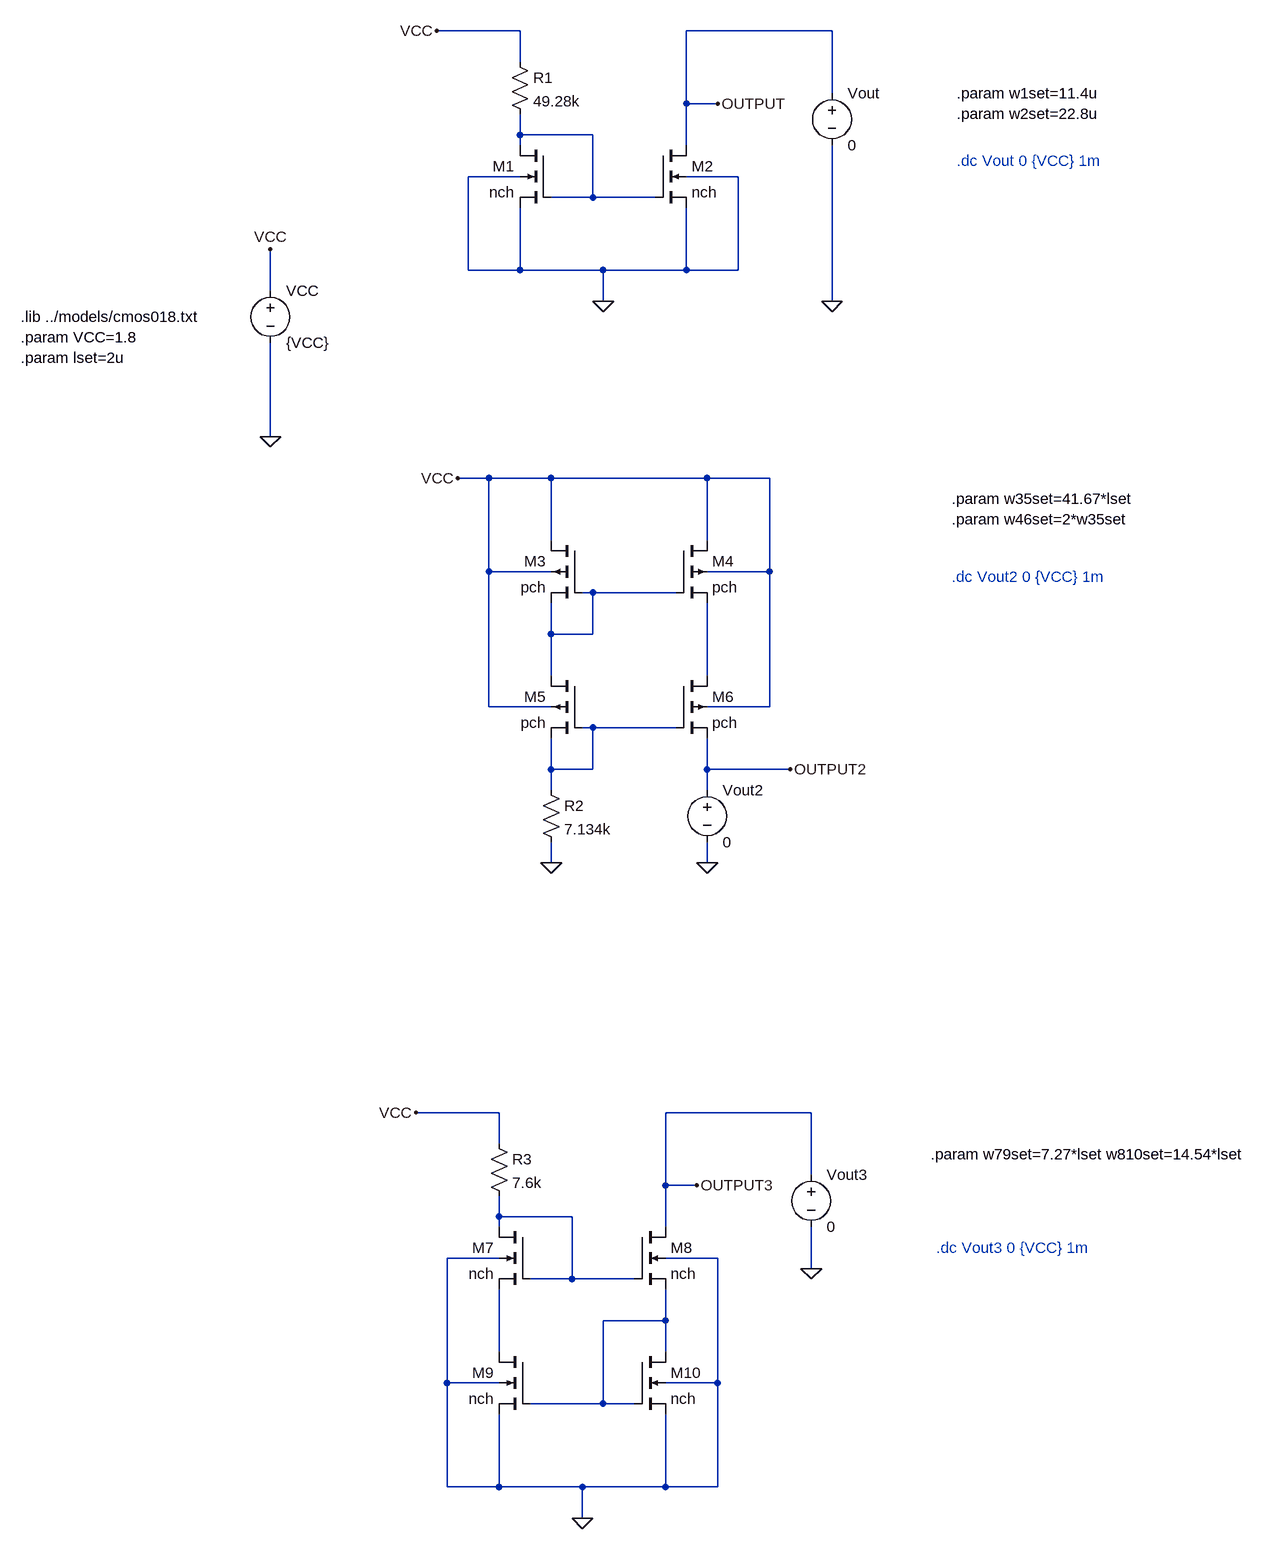
[diagram p0: schematic 2.asc]
2.asc, the LTspice schematic file:
Version 4
SHEET 1 2972 2004
WIRE 736 -304 608 -304
WIRE 1216 -304 992 -304
WIRE 736 -256 736 -304
WIRE 1216 -208 1216 -304
WIRE 992 -192 992 -304
WIRE 1040 -192 992 -192
WIRE 736 -144 736 -176
WIRE 848 -144 736 -144
WIRE 736 -128 736 -144
WIRE 992 -128 992 -192
WIRE 736 -80 656 -80
WIRE 1072 -80 992 -80
WIRE 848 -48 848 -144
WIRE 848 -48 784 -48
WIRE 944 -48 848 -48
WIRE 656 64 656 -80
WIRE 736 64 736 -32
WIRE 736 64 656 64
WIRE 864 64 736 64
WIRE 992 64 992 -32
WIRE 992 64 864 64
WIRE 1072 64 1072 -80
WIRE 1072 64 992 64
WIRE 352 96 352 32
WIRE 864 112 864 64
WIRE 1216 112 1216 -128
WIRE 352 320 352 176
WIRE 688 384 640 384
WIRE 784 384 688 384
WIRE 1024 384 784 384
WIRE 1120 384 1024 384
WIRE 784 480 784 384
WIRE 1024 480 1024 384
WIRE 688 528 688 384
WIRE 784 528 688 528
WIRE 1120 528 1120 384
WIRE 1120 528 1024 528
WIRE 848 560 832 560
WIRE 976 560 848 560
WIRE 784 624 784 576
WIRE 848 624 848 560
WIRE 848 624 784 624
WIRE 784 688 784 624
WIRE 1024 688 1024 576
WIRE 688 736 688 528
WIRE 784 736 688 736
WIRE 1120 736 1120 528
WIRE 1120 736 1024 736
WIRE 848 768 832 768
WIRE 976 768 848 768
WIRE 784 832 784 784
WIRE 848 832 848 768
WIRE 848 832 784 832
WIRE 1024 832 1024 784
WIRE 1152 832 1024 832
WIRE 784 864 784 832
WIRE 1024 864 1024 832
WIRE 784 976 784 944
WIRE 1024 976 1024 944
WIRE 704 1360 576 1360
WIRE 1184 1360 960 1360
WIRE 704 1408 704 1360
WIRE 1184 1456 1184 1360
WIRE 960 1472 960 1360
WIRE 1008 1472 960 1472
WIRE 704 1520 704 1488
WIRE 816 1520 704 1520
WIRE 704 1536 704 1520
WIRE 960 1536 960 1472
WIRE 704 1584 624 1584
WIRE 1040 1584 960 1584
WIRE 1184 1600 1184 1536
WIRE 816 1616 816 1520
WIRE 816 1616 752 1616
WIRE 912 1616 816 1616
WIRE 960 1680 960 1632
WIRE 960 1680 864 1680
WIRE 704 1728 704 1632
WIRE 960 1728 960 1680
WIRE 624 1776 624 1584
WIRE 704 1776 624 1776
WIRE 1040 1776 1040 1584
WIRE 1040 1776 960 1776
WIRE 864 1808 864 1680
WIRE 864 1808 752 1808
WIRE 912 1808 864 1808
WIRE 624 1936 624 1776
WIRE 704 1936 704 1824
WIRE 704 1936 624 1936
WIRE 832 1936 704 1936
WIRE 960 1936 960 1824
WIRE 960 1936 832 1936
WIRE 1040 1936 1040 1776
WIRE 1040 1936 960 1936
WIRE 832 1984 832 1936
FLAG 864 112 0
FLAG 352 320 0
FLAG 352 32 VCC
FLAG 608 -304 VCC
FLAG 1040 -192 OUTPUT
FLAG 1216 112 0
FLAG 640 384 VCC
FLAG 1152 832 OUTPUT2
FLAG 784 976 0
FLAG 1024 976 0
FLAG 576 1360 VCC
FLAG 1008 1472 OUTPUT3
FLAG 1184 1600 0
FLAG 832 1984 0
SYMBOL nmos4 784 -128 M0
SYMATTR InstName M1
SYMATTR Value nch
SYMATTR Value2 l=lset w=w1set
SYMBOL voltage 352 80 R0
WINDOW 123 0 0 Left 0
WINDOW 39 0 0 Left 0
SYMATTR InstName VCC
SYMATTR Value {VCC}
SYMBOL nmos4 944 -128 R0
SYMATTR InstName M2
SYMATTR Value nch
SYMATTR Value2 l=lset w=w2set
SYMBOL res 720 -272 R0
SYMATTR InstName R1
SYMATTR Value 49.28k
SYMBOL voltage 1216 -224 R0
WINDOW 123 0 0 Left 0
WINDOW 39 0 0 Left 0
SYMATTR InstName Vout
SYMATTR Value 0
SYMBOL pmos4 832 480 M0
SYMATTR InstName M3
SYMATTR Value pch
SYMATTR Value2 l=lset w=w35set
SYMBOL pmos4 976 480 R0
SYMATTR InstName M4
SYMATTR Value pch
SYMATTR Value2 l=lset w=w46set
SYMBOL pmos4 832 688 M0
SYMATTR InstName M5
SYMATTR Value pch
SYMATTR Value2 l=lset w=w35set
SYMBOL pmos4 976 688 R0
SYMATTR InstName M6
SYMATTR Value pch
SYMATTR Value2 l=lset w=w46set
SYMBOL res 768 848 R0
SYMATTR InstName R2
SYMATTR Value 7.134k
SYMBOL voltage 1024 848 R0
WINDOW 123 0 0 Left 0
WINDOW 39 0 0 Left 0
SYMATTR InstName Vout2
SYMATTR Value 0
SYMBOL nmos4 752 1536 M0
SYMATTR InstName M7
SYMATTR Value nch
SYMATTR Value2 l=lset w=w79set
SYMBOL nmos4 912 1536 R0
SYMATTR InstName M8
SYMATTR Value nch
SYMATTR Value2 l=lset w=w810set
SYMBOL res 688 1392 R0
SYMATTR InstName R3
SYMATTR Value 7.6k
SYMBOL voltage 1184 1440 R0
WINDOW 123 0 0 Left 0
WINDOW 39 0 0 Left 0
SYMATTR InstName Vout3
SYMATTR Value 0
SYMBOL nmos4 752 1728 M0
SYMATTR InstName M9
SYMATTR Value nch
SYMATTR Value2 l=lset w=w79set
SYMBOL nmos4 912 1728 R0
SYMATTR InstName M10
SYMATTR Value nch
SYMATTR Value2 l=lset w=w810set
TEXT -32 136 Left 2 !.lib ../models/cmos018.txt\n.param VCC=1.8\n.param lset=2u
TEXT 1408 -208 Left 2 !.param w1set=11.4u\n.param w2set=22.8u
TEXT 1408 -104 Left 2 ;.dc Vout 0 {VCC} 1m
TEXT 1400 416 Left 2 !.param w35set=41.67*lset\n.param w46set=2*w35set
TEXT 1400 536 Left 2 ;.dc Vout2 0 {VCC} 1m
TEXT 1368 1424 Left 2 !.param w79set=7.27*lset w810set=14.54*lset
TEXT 1376 1568 Left 2 ;.dc Vout3 0 {VCC} 1m

The netlist it stands for:
* 2.asc
M1 N001 N001 0 0 nch l=lset w=w1set
VCC VCC 0 {VCC}
M2 OUTPUT N001 0 0 nch l=lset w=w2set
R1 VCC N001 49.28k
Vout OUTPUT 0 0
M3 VCC N002 N002 VCC pch l=lset w=w35set
M4 VCC N002 N003 VCC pch l=lset w=w46set
M5 N002 N004 N004 VCC pch l=lset w=w35set
M6 N003 N004 OUTPUT2 VCC pch l=lset w=w46set
R2 N004 0 7.134k
Vout2 OUTPUT2 0 0
M7 N005 N005 N007 0 nch l=lset w=w79set
M8 OUTPUT3 N005 N006 0 nch l=lset w=w810set
R3 VCC N005 7.6k
Vout3 OUTPUT3 0 0
M9 N007 N006 0 0 nch l=lset w=w79set
M10 N006 N006 0 0 nch l=lset w=w810set
.model NMOS NMOS
.model PMOS PMOS
.lib standard.mos
.lib ../models/cmos018.txt
.param VCC=1.8
.param lset=2u
.param w1set=11.4u
.param w2set=22.8u
* .dc Vout 0 {VCC} 1m
.param w35set=41.67*lset
.param w46set=2*w35set
* .dc Vout2 0 {VCC} 1m
.param w79set=7.27*lset w810set=14.54*lset
* .dc Vout3 0 {VCC} 1m
.backanno
.end